# Altium schematic sheet Buck_Regulator.SchDoc
size A
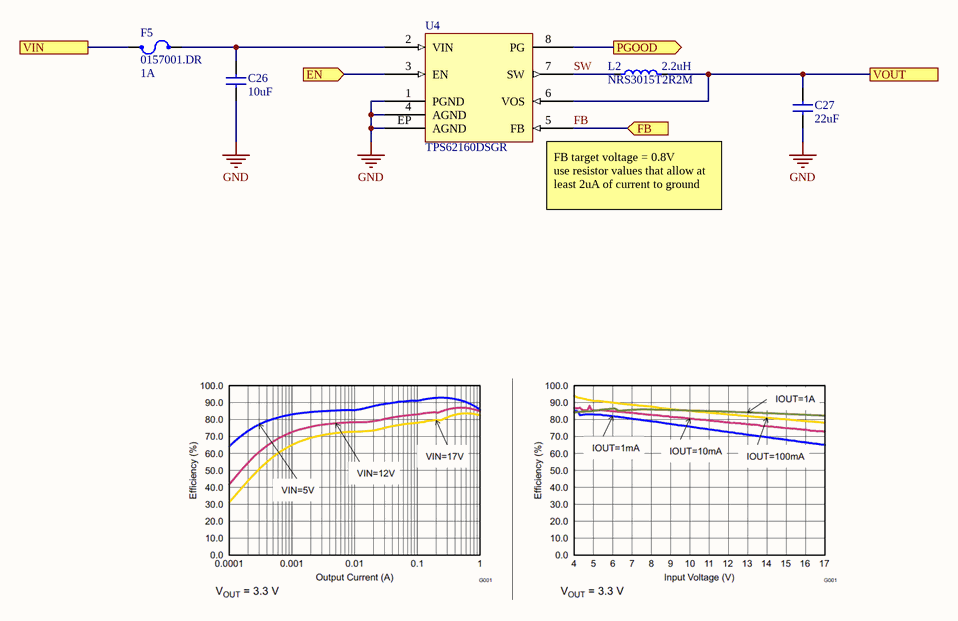
[diagram p0: Buck_Regulator.SchDoc]

## Parts
C26  value 10uF  [1206_CAPACITOR]  (hidden comment: CAP 10uF 50V X5R)
C27  value 22uF  [0805_Capacitor]  (hidden comment: CAP 22uF 16V X5R)
F5  0157001.DR  value 1A  [F_157T]
L2  NRS3015T2R2M  value 2.2uH  [L_NRS_Series_3.0x3.0mm]
U4  TPS62160DSGR  [WFDFN-8-EP]

## Ports
EN (in), FB (in), PGOOD (out), VIN, VOUT

## Nets
GND: C26.2 C27.2 U4.1(PGND) U4.4(AGND) U4.EP(AGND)
EN: U4.3(EN) ; port EN
FB: U4.5(FB) ; port FB
PGOOD: U4.8(PG) ; port PGOOD
SW: L2.1 U4.7(SW)
VIN: F5.1 ; port VIN
VOUT: C27.1 L2.2 U4.6(VOS) ; port VOUT
NetC26_1: C26.1 F5.2 U4.2(VIN)

## Notes on the sheet
- (near U4) FB target voltage = 0.8V
  use resistor values that allow at least 2uA of current to ground

## Library data of the parts
C26 = C_1206_10uF_50V_20%: CAP CERM 10uF 20% 50V 1206; SVP Creator: Spencer Berglund; Package: =SelectedPackage; Voltage: 50V; Temperature Coefficient: X5R; Supplier 1: Digi-Key; Supplier Part Number 1: 1276-6736-6-ND
C27 = C_0805_22uF_16V_20%: CAP CERM 22uF 20% 16V 0805; Package: =SelectedPackage; Voltage: 16V; Temperature Coefficient: X5R; Supplier 1: Digi-Key; Supplier Part Number 1: 1276-6780-6-ND
F5 = F_0157001.DR: FUSE BRD MNT 1A 125VAC/VDC 2SMD; Manufacturer: Littelfuse; Voltage Rating (AC): 125V; DC Cold Resistance: 153.7mR; Supplier 1: Digi-Key; Max Operating Temperature: 125°C; Manufacturer Part Number: 0157001.DR; Fuse Current: 1A; Min Operating Temperature: -55°C; Current Rating: 1A; Voltage Rating (DC): 125V; Supplier Part Number 1: F2962DKR-ND
L2 = L_NRS3015T2R2M: Manufacturer Part Number: NRS3015T2R2MNGH; Manufacturer: Taiyo Yuden; Test Frequency: 100kHz; Current Rating: 1.5A; Saturation Current: 1.48A; Shielding: Shielded; Core Material: Ferrite; Tolerance: 20%; DC Resistance (DCR): 58mR; Self Resonant Frequency: 64MHz; Supplier 1: Digi-Key; Supplier 2: Digi-Key; Supplier Part Number 1: 587-3561-6-ND; Supplier Part Number 2: 587-1648-6-ND; Max Operating Temperature: 120°C; Composition: Wirewound; Min Operating Temperature: -25°C; Case/Package: Nonstandard
U4 = U_TPS62160: Buck Switching Regulator IC Positive Adjustable 0.9V 1 Output 1A; Supplier 1: Digi-Key; Supplier Part Number 1: 296-29895-6-ND